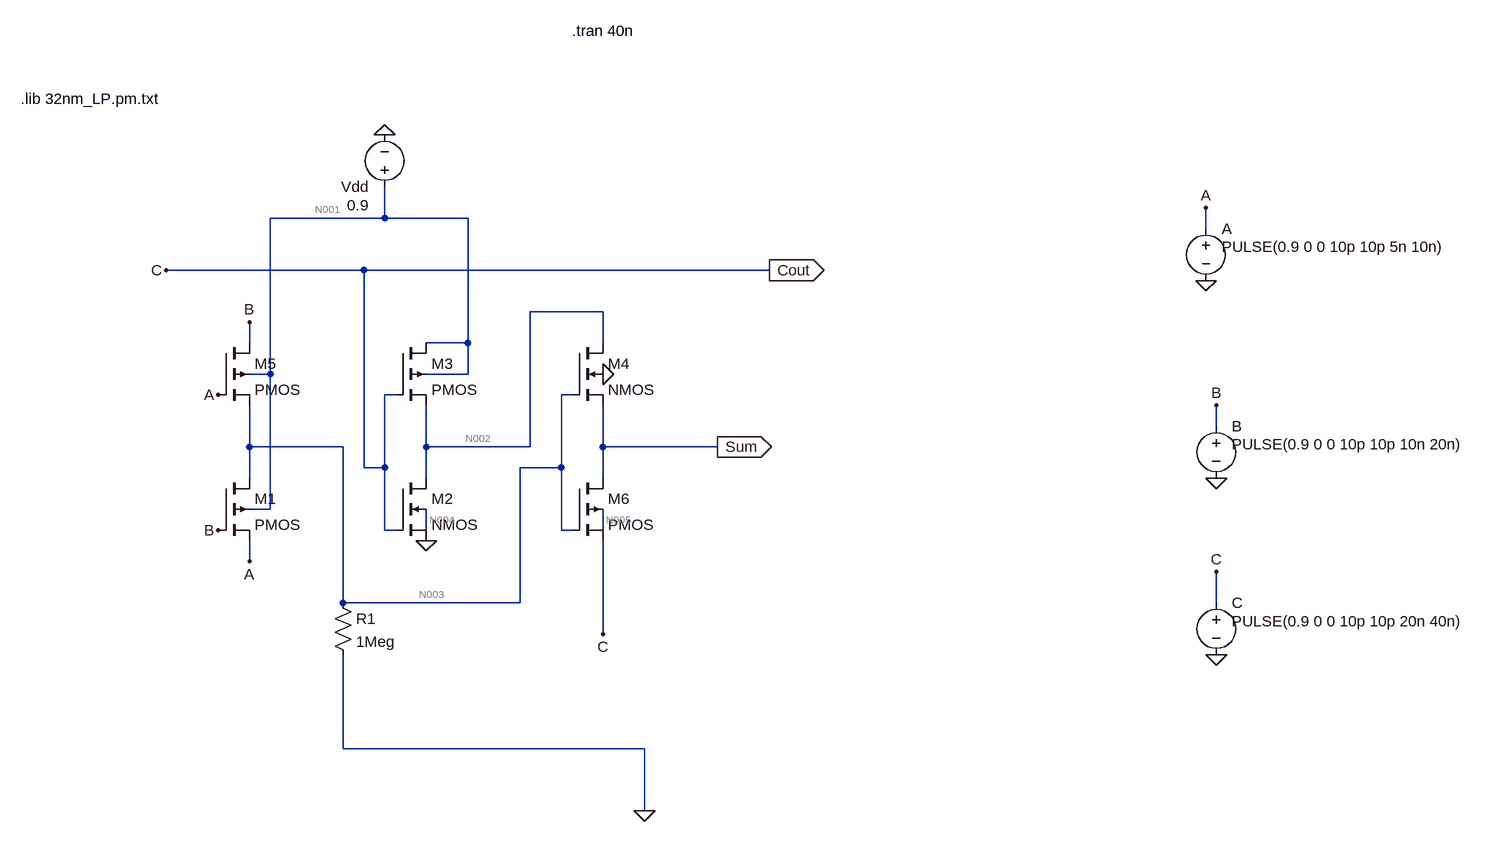
[diagram p0: schematic InXA1_32nm.asc]
InXA1_32nm.asc, the LTspice schematic file:
Version 4
SHEET 1 1044 692
WIRE -640 -240 -640 -288
WIRE -640 -240 -816 -240
WIRE -512 -240 -640 -240
WIRE 624 -224 624 -256
WIRE -672 -160 -976 -160
WIRE -48 -160 -672 -160
WIRE -304 -96 -416 -96
WIRE -848 -48 -848 -80
WIRE -512 -48 -512 -240
WIRE -512 -48 -576 -48
WIRE -304 -48 -304 -96
WIRE -816 0 -816 -240
WIRE -816 0 -848 0
WIRE -512 0 -512 -48
WIRE -512 0 -576 0
WIRE -624 32 -640 32
WIRE -352 32 -368 32
WIRE 640 80 640 48
WIRE -848 112 -848 48
WIRE -704 112 -848 112
WIRE -576 112 -576 48
WIRE -416 112 -416 -96
WIRE -416 112 -576 112
WIRE -304 112 -304 48
WIRE -128 112 -304 112
WIRE -672 144 -672 -160
WIRE -640 144 -640 32
WIRE -640 144 -672 144
WIRE -368 144 -368 32
WIRE -368 144 -432 144
WIRE -848 160 -848 112
WIRE -576 160 -576 112
WIRE -304 160 -304 112
WIRE -816 208 -816 0
WIRE -816 208 -848 208
WIRE -640 240 -640 144
WIRE -624 240 -640 240
WIRE -576 240 -576 208
WIRE -368 240 -368 144
WIRE -352 240 -368 240
WIRE -304 240 -304 208
WIRE -848 288 -848 256
WIRE -704 352 -704 112
WIRE -432 352 -432 144
WIRE -432 352 -704 352
WIRE 640 352 640 304
WIRE -304 400 -304 256
WIRE -704 576 -704 432
WIRE -240 576 -704 576
WIRE -240 672 -240 576
FLAG -240 672 0
FLAG 624 -144 0
FLAG 640 160 0
FLAG 640 432 0
FLAG 624 -256 A
FLAG 640 48 B
FLAG -640 -368 0
FLAG -304 400 C
FLAG -896 32 A
FLAG -896 240 B
FLAG -48 -160 Cout
IOPIN -48 -160 Out
FLAG -976 -160 C
FLAG -128 112 Sum
IOPIN -128 112 Out
FLAG -576 256 0
FLAG -848 288 A
FLAG -848 -80 B
FLAG 640 304 C
FLAG -304 0 0
SYMBOL voltage 624 -240 R0
WINDOW 3 24 44 Left 2
WINDOW 123 0 0 Left 0
WINDOW 39 0 0 Left 0
SYMATTR Value PULSE(0.9 0 0 10p 10p 5n 10n)
SYMATTR InstName A
SYMBOL voltage 640 64 R0
WINDOW 3 24 44 Left 2
WINDOW 123 0 0 Left 0
WINDOW 39 0 0 Left 0
SYMATTR Value PULSE(0.9 0 0 10p 10p 10n 20n)
SYMATTR InstName B
SYMBOL voltage 640 336 R0
WINDOW 3 24 44 Left 2
WINDOW 123 0 0 Left 0
WINDOW 39 0 0 Left 0
SYMATTR Value PULSE(0.9 0 0 10p 10p 20n 40n)
SYMATTR InstName C
SYMBOL voltage -640 -272 R180
WINDOW 3 24 -12 Left 2
WINDOW 123 0 0 Left 0
WINDOW 39 0 0 Left 0
SYMATTR Value 0.9
SYMATTR InstName Vdd
SYMBOL nmos4 -624 160 R0
SYMATTR InstName M2
SYMATTR Value2 l=32n w=64n
SYMBOL nmos4 -352 -48 R0
SYMATTR InstName M4
SYMATTR Value2 l=32n w=64n
SYMBOL pmos4 -896 -48 R0
SYMATTR InstName M5
SYMATTR Value2 l=32n w=128n
SYMBOL res -720 336 R0
SYMATTR InstName R1
SYMATTR Value 1Meg
SYMBOL pmos4 -896 160 R0
SYMATTR InstName M1
SYMATTR Value2 l=32n w=128n
SYMBOL pmos4 -624 -48 R0
SYMATTR InstName M3
SYMATTR Value2 l=32n w=128n
SYMBOL pmos4 -352 160 R0
SYMATTR InstName M6
SYMATTR Value2 l=32n w=128n
TEXT -1200 -424 Left 2 !.lib 32nm_LP.pm.txt
TEXT -352 -528 Left 2 !.tran 40n

The netlist it stands for:
* InXA1_32nm.asc
V§A A 0 PULSE(0.9 0 0 10p 10p 5n 10n)
V§B B 0 PULSE(0.9 0 0 10p 10p 10n 20n)
V§C Cout 0 PULSE(0.9 0 0 10p 10p 20n 40n)
Vdd N001 0 0.9
M2 N002 Cout 0 N004 NMOS l=32n w=64n
M4 N002 N003 Sum 0 NMOS l=32n w=64n
M5 B A N003 N001 PMOS l=32n w=128n
R1 N003 0 1Meg
M1 N003 B A N001 PMOS l=32n w=128n
M3 N001 Cout N002 N001 PMOS l=32n w=128n
M6 Sum N003 Cout N005 PMOS l=32n w=128n
.model NMOS NMOS
.model PMOS PMOS
.lib standard.mos
.lib 32nm_LP.pm.txt
.tran 40n
.backanno
.end

* Results of the author's LTspice run, read from the files saved beside the schematic
* Operating Point, zero values left out:
*   V(a) = 900 mV
*   V(b) = 900 mV
*   V(cout) = 900 mV
*   V(n001) = 900 mV
*   V(n002) = 19.91 µV
*   V(n004) = 111.8 mV
*   V(n003) = 4.682 mV
*   V(sum) = 900 mV
*   V(n005) = 767.2 mV
*   Id(M6) = -3.176 nA
*   Ig(M6) = -1.191 pA
*   Is(M6) = 3.178 nA
*   Id(M3) = 2.414 nA
*   Is(M3) = -2.415 nA
*   Id(M1) = -2.33 nA
*   Is(M1) = 2.329 nA
*   Id(M5) = 2.329 nA
*   Is(M5) = -2.33 nA
*   Id(M4) = -3.154 nA
*   Ig(M4) = -21.21 pA
*   Is(M4) = 3.176 nA
*   Id(M2) = 5.569 nA
*   Ig(M2) = 36.17 pA
*   Is(M2) = -5.605 nA
*   I(R1) = 4.682 nA
*   I(Vdd) = -2.417 nA
*   I(C) = -3.214 nA
*   I(B) = -2.329 nA
*   I(A) = -2.329 nA
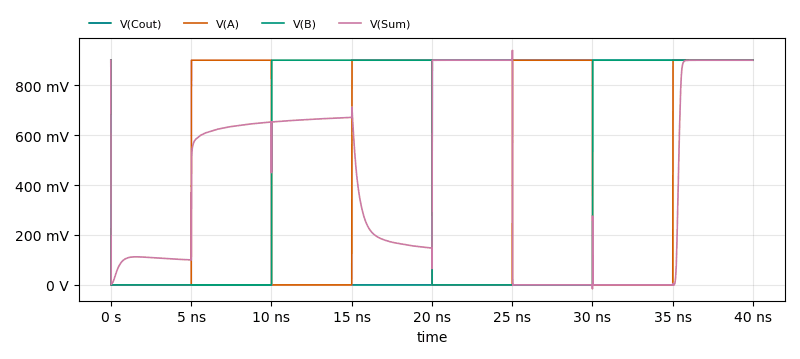
[diagram p1: Transient Analysis of InXA1_32nm.asc, plotted from the saved traces]
* Transient Analysis, 1 run:
*   V(Cout): min 0 V, max 900 mV, average 449.8 mV, rms 636.2 mV, last 900 mV
*   V(A): min 0 V, max 900 mV, average 449.1 mV, rms 635.6 mV, last 900 mV
*   V(B): min 0 V, max 900 mV, average 449.5 mV, rms 636 mV, last 900 mV
*   V(Sum): min -15.59 mV, max 939.3 mV, average 417.2 mV, rms 553.5 mV, last 900 mV